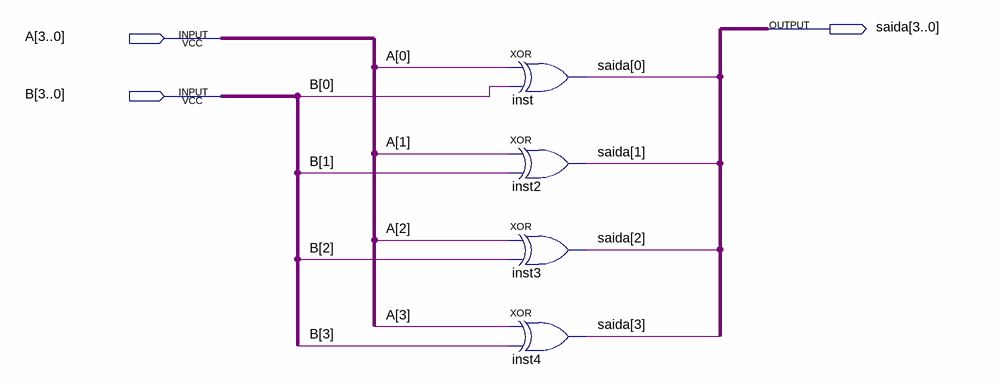
[diagram p0: schematic sheet]
// Quartus schematic xoor.bdf as structural Verilog: 4 symbols, 3 pins
module xoor (
  input  [3:0] A,
  input  [3:0] B,
  output [3:0] saida
);

  xor inst (saida[0], A[0], B[0]);
  xor inst2 (saida[1], A[1], B[1]);
  xor inst3 (saida[2], A[2], B[2]);
  xor inst4 (saida[3], A[3], B[3]);
endmodule
